# EAGLE design KimCard-v2 (EAGLE 5.11)
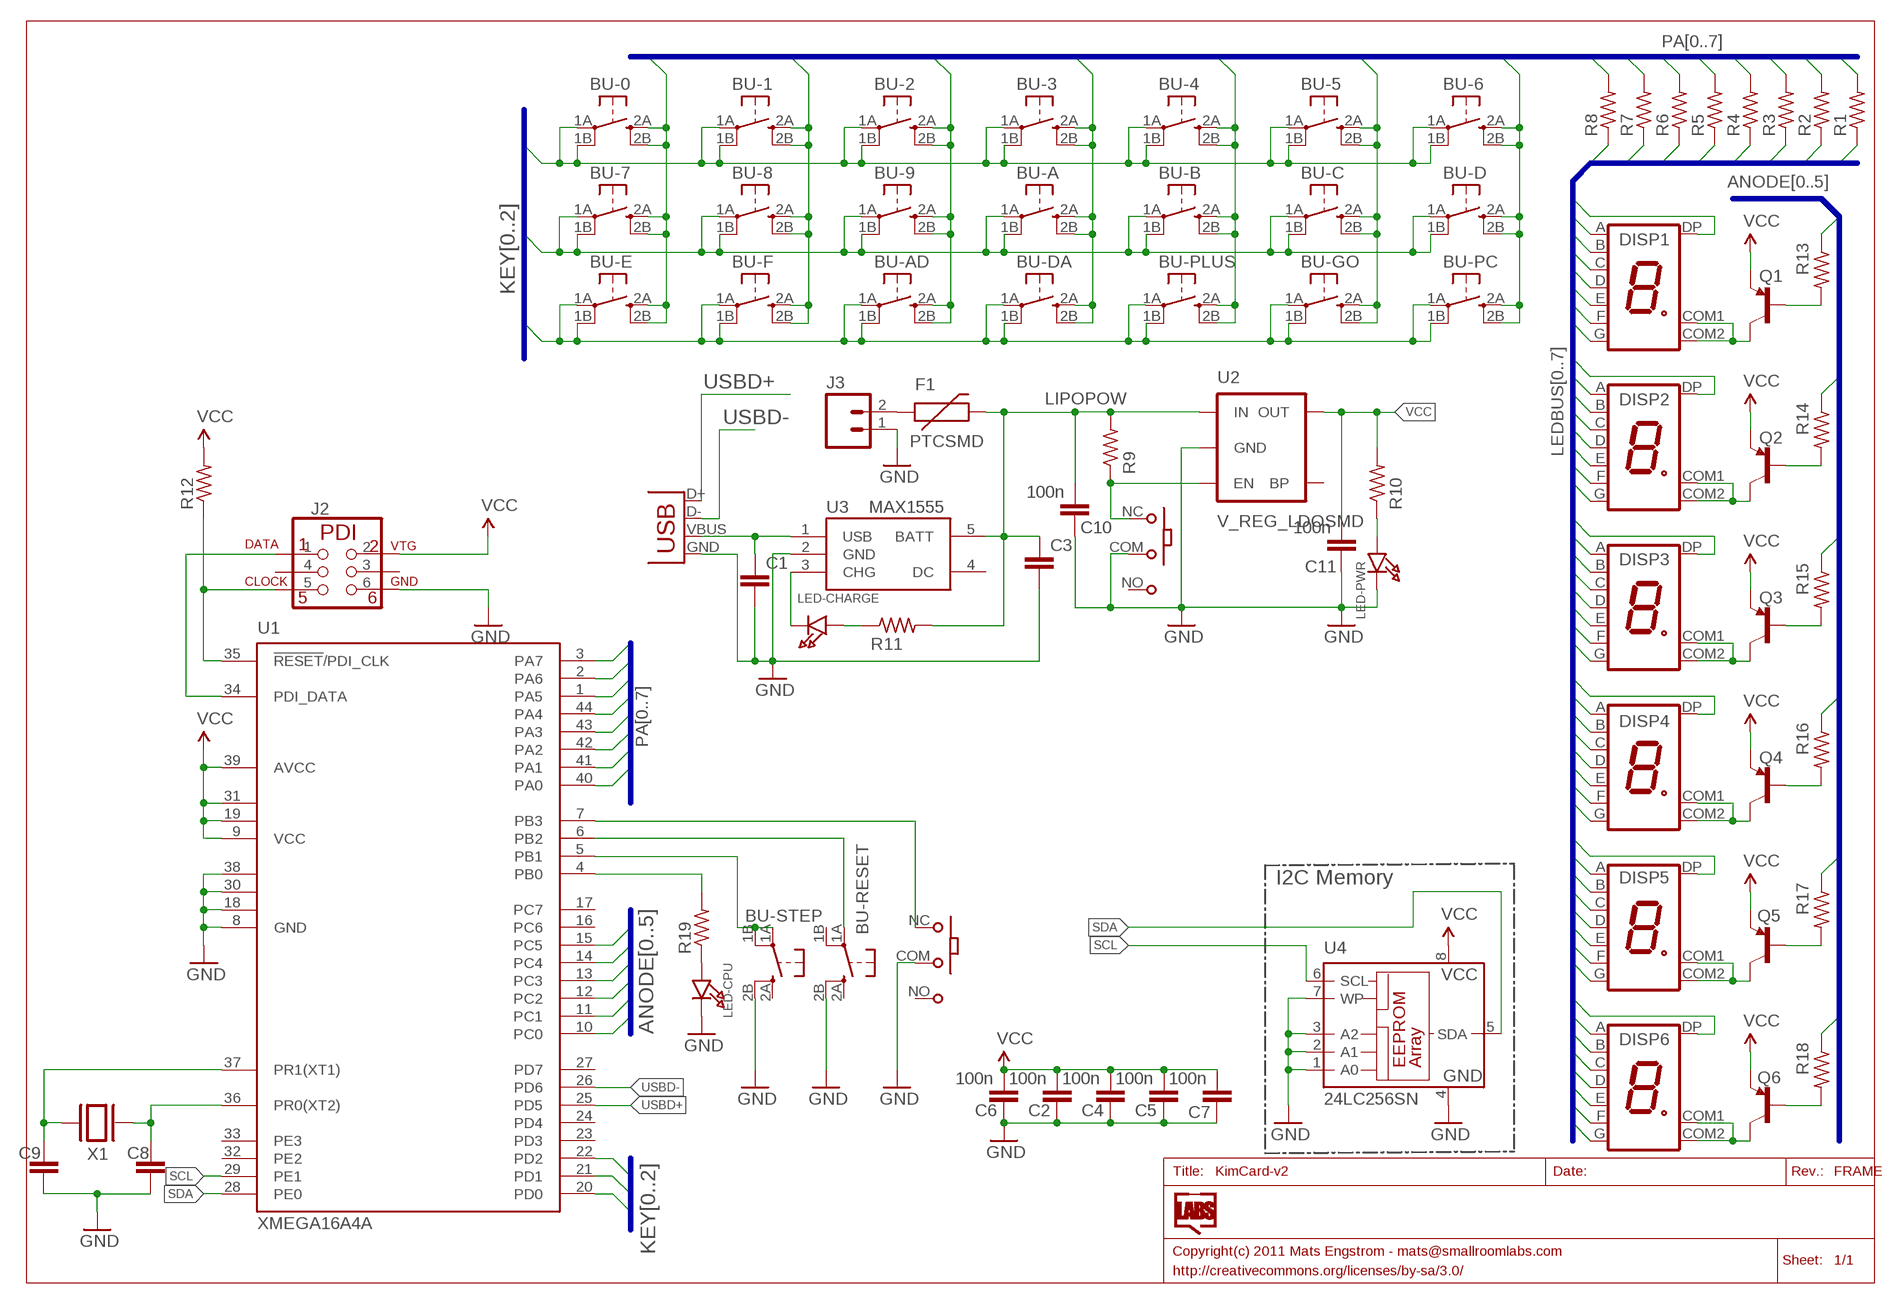
[diagram p0: schematic, sheet 1]

## Parts
BU-0  TACTILE  [EVQ-Q2]
BU-1  TACTILE  [EVQ-Q2]
BU-2  TACTILE  [EVQ-Q2]
BU-3  TACTILE  [EVQ-Q2]
BU-4  TACTILE  [EVQ-Q2]
BU-5  TACTILE  [EVQ-Q2]
BU-6  TACTILE  [EVQ-Q2]
BU-7  TACTILE  [EVQ-Q2]
BU-8  TACTILE  [EVQ-Q2]
BU-9  TACTILE  [EVQ-Q2]
BU-A  TACTILE  [EVQ-Q2]
BU-AD  TACTILE  [EVQ-Q2]
BU-B  TACTILE  [EVQ-Q2]
BU-C  TACTILE  [EVQ-Q2]
BU-D  TACTILE  [EVQ-Q2]
BU-DA  TACTILE  [EVQ-Q2]
BU-E  TACTILE  [EVQ-Q2]
BU-F  TACTILE  [EVQ-Q2]
BU-GO  TACTILE  [EVQ-Q2]
BU-PC  TACTILE  [EVQ-Q2]
BU-PLUS  TACTILE  [EVQ-Q2]
BU-RESET  TACTILE  [EVQ-Q2]
BU-STEP  TACTILE  [EVQ-Q2]
C1  CAP0805  [0805]
C2  100n  CAP0805  [0805]
C3  CAP0805  [0805]
C4  100n  CAP0805  [0805]
C5  100n  CAP0805  [0805]
C6  100n  CAP0805  [0805]
C7  100n  CAP0805  [0805]
C8  CAP0805  [0805]
C9  CAP0805  [0805]
C10  100n  CAP0805  [0805]
C11  100n  CAP0805  [0805]
DISP1  7SEG  [TDS11]
DISP2  7SEG  [TDS11]
DISP3  7SEG  [TDS11]
DISP4  7SEG  [TDS11]
DISP5  7SEG  [TDS11]
DISP6  7SEG  [TDS11]
F1  PTCSMD  [PTC-1206]
J1  USB-MICROB  [USB-MICROB]
J2  PDI-EXTRA  [ISP-TOUCH-PDI-SOLDER]
J3  LIPO-BAT  M02-JST-2MM-SMT  [JST-2-SMD]
LED-CHARGE  LEDSMD0805  [CHIPLED_0805]
LED-CPU  LEDSMD0805  [CHIPLED_0805]
LED-PWR  LEDSMD0805  [CHIPLED_0805]
Q1  TRANSISTOR_PNPSMD  [SOT23-3]
Q2  TRANSISTOR_PNPSMD  [SOT23-3]
Q3  TRANSISTOR_PNPSMD  [SOT23-3]
Q4  TRANSISTOR_PNPSMD  [SOT23-3]
Q5  TRANSISTOR_PNPSMD  [SOT23-3]
Q6  TRANSISTOR_PNPSMD  [SOT23-3]
R1  RES0805A  [R0805A]
R2  RES0805A  [R0805A]
R3  RES0805A  [R0805A]
R4  RES0805A  [R0805A]
R5  RES0805A  [R0805A]
R6  RES0805A  [R0805A]
R7  RES0805A  [R0805A]
R8  RES0805A  [R0805A]
R9  RES0805A  [R0805A]
R10  RES0805A  [R0805A]
R11  RES0805A  [R0805A]
R12  RES0805A  [R0805A]
R13  RES0805A  [R0805A]
R14  RES0805A  [R0805A]
R15  RES0805A  [R0805A]
R16  RES0805A  [R0805A]
R17  RES0805A  [R0805A]
R18  RES0805A  [R0805A]
R19  RES0805A  [R0805A]
U1  XMEGA16A4A  [TQFP44]
U2  V_REG_LDOSMD  [SOT23-5]
U3  MAX1555  [SOT23-5]
U4  24LC256SN  [SO-08]
U$1  SLIDESWITCHPCM12SMTR  [PCM12SMTR]
U$2  SLIDESWITCHPCM12SMTR  [PCM12SMTR]
X1  XTAL12SMX-B  [12SMX-B]

## Nets
CHRG-A: LED-CHARGE.C U3.3(CHG)
CHRG-B: LED-CHARGE.A R11.1
CPU: R19.2 U1.4(PB0)
GND [pwr2]: BU-RESET.2B BU-STEP.2B C1.2 C2.1 C3.2 C4.1 C5.1 C6.1 C7.1 C8.1 C9.1 C10.1 C11.1 J1.GND J2.6(GND) J3.1 LED-CPU.C LED-PWR.C U1.8(GND) U1.18(GND1) U1.30(GND2) U1.38(GND3) U2.2(GND) U3.2(GND) U4.1(A0) U4.2(A1) U4.3(A2) U4.4(GND) U4.7(WP) U$1.COM U$2.COM
KEYROW0: BU-0.1A BU-0.1B BU-1.1A BU-1.1B BU-2.1A BU-2.1B BU-3.1A BU-3.1B BU-4.1A BU-4.1B BU-5.1A BU-5.1B BU-6.1A BU-6.1B U1.20(PD0)
KEYROW1: BU-7.1A BU-7.1B BU-8.1A BU-8.1B BU-9.1A BU-9.1B BU-A.1A BU-A.1B BU-B.1A BU-B.1B BU-C.1A BU-C.1B BU-D.1A BU-D.1B U1.21(PD1)
KEYROW2: BU-AD.1A BU-AD.1B BU-DA.1A BU-DA.1B BU-E.1A BU-E.1B BU-F.1A BU-F.1B BU-GO.1A BU-GO.1B BU-PC.1A BU-PC.1B BU-PLUS.1A BU-PLUS.1B U1.22(PD2)
LEDBUS0: DISP1.A DISP2.A DISP3.A DISP4.A DISP5.A DISP6.A R1.1
LEDBUS1: DISP1.B DISP2.B DISP3.B DISP4.B DISP5.B DISP6.B R2.1
LEDBUS2: DISP1.C DISP2.C DISP3.C DISP4.C DISP5.C DISP6.C R3.1
LEDBUS3: DISP1.D DISP2.D DISP3.D DISP4.D DISP5.D DISP6.D R4.1
LEDBUS4: DISP1.E DISP2.E DISP3.E DISP4.E DISP5.E DISP6.E R5.1
LEDBUS5: DISP1.F DISP2.F DISP3.F DISP4.F DISP5.F DISP6.F R6.1
LEDBUS6: DISP1.G DISP2.G DISP3.G DISP4.G DISP5.G DISP6.G R7.1
LEDBUS7: DISP1.DP DISP2.DP DISP3.DP DISP4.DP DISP5.DP DISP6.DP R8.1
LEDCA0: R13.1 U1.10(PC0)
LEDCA1: R14.1 U1.11(PC1)
LEDCA2: R15.1 U1.12(PC2)
LEDCA3: R16.1 U1.13(PC3)
LEDCA4: R17.1 U1.14(PC4)
LEDCA5: R18.1 U1.15(PC5)
LIPO+ [pwr1]: F1.1 J3.2
LIPOPOW [pwr2]: C3.1 C10.2 F1.2 R9.2 R11.2 U2.1(IN) U3.5(BATT)
N$1: C8.2 U1.36(PR0(XT2)) X1.XTAL1
N$5: LED-PWR.A R10.1
N$7: LED-CPU.A R19.1
PA0: BU-0.2A BU-0.2B BU-7.2A BU-7.2B BU-E.2A BU-E.2B R1.2 U1.40(PA0)
PA1: BU-1.2A BU-1.2B BU-8.2A BU-8.2B BU-F.2A BU-F.2B R2.2 U1.41(PA1)
PA2: BU-2.2A BU-2.2B BU-9.2A BU-9.2B BU-AD.2A BU-AD.2B R3.2 U1.42(PA2)
PA3: BU-3.2A BU-3.2B BU-A.2A BU-A.2B BU-DA.2A BU-DA.2B R4.2 U1.43(PA3)
PA4: BU-4.2A BU-4.2B BU-B.2A BU-B.2B BU-PLUS.2A BU-PLUS.2B R5.2 U1.44(PA4)
PA5: BU-5.2A BU-5.2B BU-C.2A BU-C.2B BU-GO.2A BU-GO.2B R6.2 U1.1(PA5)
PA6: BU-6.2A BU-6.2B BU-D.2A BU-D.2B BU-PC.2A BU-PC.2B R7.2 U1.2(PA6)
PA7: R8.2 U1.3(PA7)
PDI_CLOCK: J2.5(CLOCK) R12.1 U1.35(!RESET!/PDI_CLK)
PDI_DATA: J2.1(DATA) U1.34(PDI_DATA)
POWER-ENABLE: R9.1 U2.3(EN) U$1.NC
Q1B: Q1.1(B) R13.2
Q1C: DISP1.COM1(CA) DISP1.COM2(CA) Q1.3(C)
Q2B: Q2.1(B) R14.2
Q2C: DISP2.COM1(CA) DISP2.COM2(CA) Q2.3(C)
Q3B: Q3.1(B) R15.2
Q3C: DISP3.COM1(CA) DISP3.COM2(CA) Q3.3(C)
Q4B: Q4.1(B) R16.2
Q4C: DISP4.COM1(CA) DISP4.COM2(CA) Q4.3(C)
Q5B: Q5.1(B) R17.2
Q5C: DISP5.COM1(CA) DISP5.COM2(CA) Q5.3(C)
Q6B: Q6.1(B) R18.2
Q6C: DISP6.COM1(CA) DISP6.COM2(CA) Q6.3(C)
RSET: BU-RESET.1A U1.6(PB2)
SCL: U1.29(PE1) U4.6(SCL)
SDA: U1.28(PE0) U4.5(SDA)
SST: U1.7(PB3) U$2.NC
STEP: BU-STEP.1A BU-STEP.1B U1.5(PB1)
USBD+: J1.D+ U1.25(PD5)
USBD-: J1.D- U1.26(PD6)
USBPOW [pwr1]: C1.1 J1.VBUS U3.1(USB)
VCC [pwr1]: C2.2 C4.2 C5.2 C6.2 C7.2 C11.2 J2.2(VTG) Q1.2(E) Q2.2(E) Q3.2(E) Q4.2(E) Q5.2(E) Q6.2(E) R10.2 R12.2 U1.9(VCC) U1.19(VCC1) U1.31(VCC2) U1.39(AVCC) U2.5(OUT) U4.8(VCC)
XTAL1: C9.2 U1.37(PR1(XT1)) X1.XTAL2
Unconnected: BU-RESET.1B BU-RESET.2A BU-STEP.2A J2.3(N/C2) J2.4(N/C1) U1.16(PC6) U1.17(PC7) U1.23(PD3) U1.24(PD4) U1.27(PD7) U1.32(PE2) U1.33(PE3) U2.4(BP) U3.4(DC) U$1.NO U$2.NO

## Buses
LEDBUS[0..7]
PA[0..7]
ANODE[0..5]
KEY[0..2]

## Notes on the sheet
- I2C Memory

## Library data of the parts
BU-0 BU-1-BU-9 BU-A BU-AD BU-B BU-C BU-D BU-DA BU-E BU-F BU-GO BU-PC BU-PLUS BU-RESET BU-STEP = SmallRoomLabs:TACTILE
C1-C11 = SparkFun:CAP: Capacitor Standard 0603 ceramic capacitor, and 0.1" leaded capacitor.
DISP1-DISP6 = Nerdlabs:7SEG
F1 = SparkFun:PTC: Resettable Fuse PTC Resettable Fuse. Spark Fun Electronics SKU : COM-08357
J1 = SparkFun:USB: USB Connectors USB-B-PTH is fully proven SKU : PRT-00139 USB-miniB is fully proven SKU : PRT-00587 USB-A-PCB is untested. USB-A-H is throughly reviewed, but untested. Spark Fun Electronics SKU : PRT-00437 USB-B-SMT is throughly reviewed, but untested. Needs silkscreen touching up. USB-A-S has not been used/tested USB-MB-H has not been used/tested
J2 = SmallRoomLabs:PDI
J3 = SparkFun:M02: Header 2 Standard 2-pin 0.1" header. Use with straight break away headers (SKU : PRT-00116), right angle break away headers (PRT-00553), swiss pins (PRT-00743), machine pins (PRT-00117), and female headers (PRT-00115). Molex polarized connector foot print use with SKU : PRT-08233 with associated crimp pins and housings.
LED-CHARGE LED-CPU LED-PWR = SmallRoomLabs:LED
Q1-Q6 = SparkFun:TRANSISTOR_PNP
R1-R19 = SmallRoomLabs:RES
U1 = atmel:XMEGA16A4: MICROCONTROLLER Features High-performance, Low-power 8/16-bit AVR XMEGA Microcontroller Non-Volatile Program and Data Memories - 16 KB - 128 KB of In-System Self-Programmable Flash - 4 KB - 8 KB Boot Code Section with Independent Lock Bits - 1 KB - 2 KB EEPROM - 2 KB - 8 KB Internal SRAM Peripheral Features - Four-channel DMA Controller with support for external requests - Eight-channel Event System - Five 16-bit Timer/Counters Three Timer/Counters with 4 Output Compare or Input Capture channels Two Timer/Counters with 2 Output Compare or Input Capture channels High-Resolution Extensions on all Timer/Counters Advanced Waveform Extension on one Timer/Counter - Five USARTs IrDA Extension on one USART - Two Two-Wire Interfaces with dual address match (I2C and SMBus compatible) - Two SPIs (Serial Peripheral Interfaces) peripherals - AES and DES Crypto Engine - 16-bit Real Time Counter with Separate Oscillator - One Twelve-channel, 12-bit, 2 Msps Analog to Digital Converter - One Two-channel, 12-bit, 1 Msps Digital to Analog Converter - Two Analog Comparators with Window compare function - External Interrupts on all General Purpose I/O pins - Programmable Watchdog Timer with Separate On-chip Ultra Low Power Oscillator Special Microcontroller Features - Power-on Reset and Programmable Brown-out Detection - Internal and External Clock Options with PLL - Programmable Multi-level Interrupt Controller - Sleep Modes: Idle, Power-down, Standby, Power-save, Extended Standby - Advanced Programming, Test and Debugging Interfaces PDI (Program and Debug Interface) for programming, test and debugging I/O and Packages - 34 Programmable I/O Lines - 44 - lead TQFP - 44 - pad VQFN/QFN - 49 - ball VFBGA Operating Voltage - 1.6 - 3.6V Speed performance - 0 - 12 MHz @ 1.6 - 3.6V - 0 - 32 MHz @ 2.7 - 3.6V Drawn by Dipl.-Ing. (FH) Robert Siegler Created: 27.05.09; OC_FARNELL: unknown; OC_NEWARK: unknown
U2 = SparkFun:V_REG_LDO: Voltage Regulator LDO Standard 150mA LDO voltage regulator in SOT-23 layout. Micrel part MIC5205. BP (by-pass) pin is used to lower output noise with 470pF cap.
U3 = SparkFun:MAX1555: MAX1555 Lithium Charger IC SOT-23 Lithium Polymer charging IC. Schematic element and footprint proven. Spark Fun Electronics SKU : COM-00674
U4 = microchip:24*: Serial EEPROM I2C; MF: MICROCHIP; MPN: 24LC256-I/SN; OC_FARNELL: 9757996; OC_NEWARK: 27C9144
U$1 U$2 = Nerdlabs:SLIDESWITCH
X1 = SmallRoomLabs:XTAL

## Net classes
0 default: width 0.203 mm, drill 0.305 mm, clearance 0.203 mm
1 pwr1: width 0.203 mm, drill 0.305 mm, clearance 0.203 mm
2 gnd1: width 0.203 mm, drill 0.305 mm, clearance 0.203 mm
3 pwr2: width 0.203 mm, drill 0.305 mm, clearance 0.203 mm

## Board
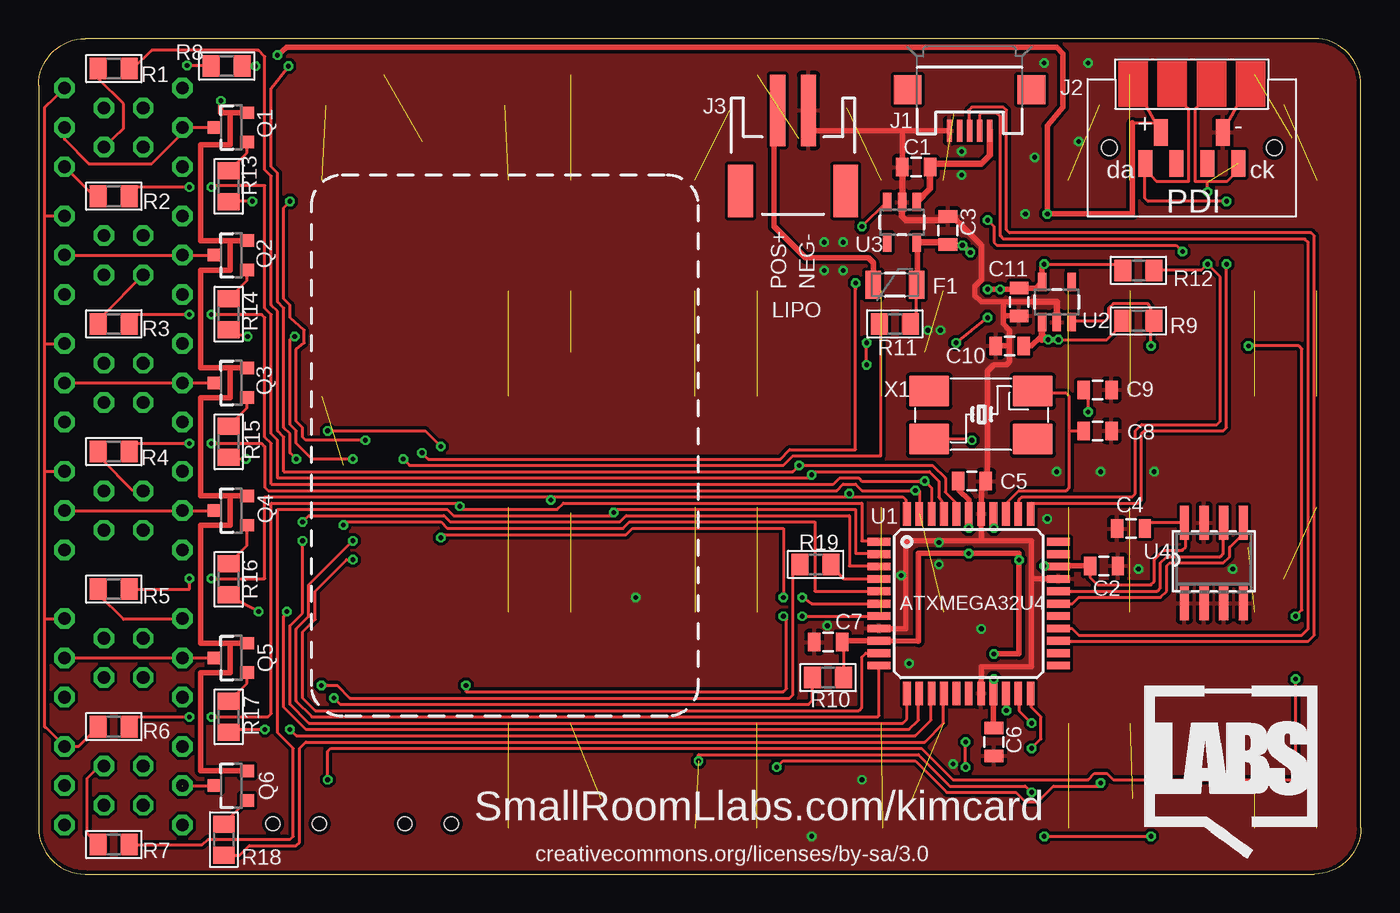
[diagram p1: board, top side]
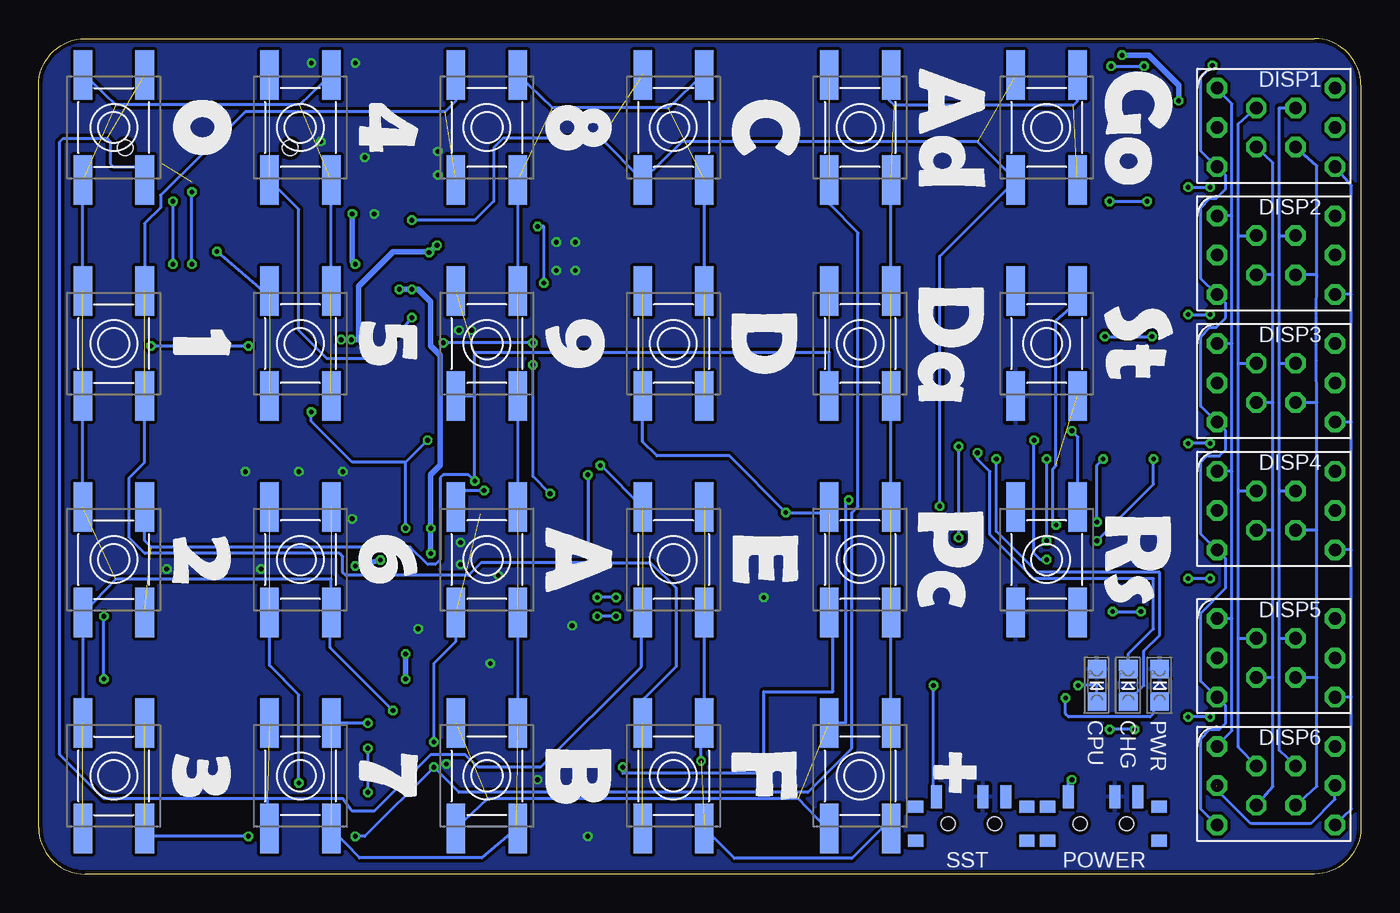
[diagram p2: board, bottom side, seen from below]

Size 85.5 x 54 mm. Coordinates in mm from the lower left corner, seen from the top.
Outline: 85.5,3 arc-90 82.5,0 3,0 arc-90 0,3 0,51 arc-90 3,54 82.5,54 arc-90 85.5,51 85.5,3
Copper layers (1*16): Top 0.035mm / dielectric 1.5mm / Bottom 0.035mm
Design rules "Fusion_eagle_rule_v1.1": minimum track width 6mil, minimum drill 12mil, track to track 6mil, track to pad 6mil, pad to pad 6mil, via to via 6mil, smd to smd 0mil, copper to edge 10mil, drill to drill 10mil, minimum pad ring 10mil, minimum via ring 6mil, stop-mask expansion 2mil, vias tented up to drill 100mil, thermal gap 10mil

### Footprints (pad centres in the part's own frame; a part is rotated, then mirrored left to right if it is on the bottom)
EVQ-Q2 = smd 3.2 x 1.2: 1A -3.4,2; 1B 3.4,2; 2A -3.4,-2; 2B 3.4,-2
0805 = smd 0.8 x 1.2: 1 -0.9,0; 2 0.9,0
TDS11 = drill 0.813 octagon: A 1.27,1.27; B 2.54,3.81; C 1.27,-1.27; COM1 0,-3.81; COM2 0,3.81; D -1.27,-1.27; DP 2.54,-3.81; E -2.54,-3.81; F -2.54,3.81; G -1.27,1.27
PTC-1206 = smd 1 x 1.8: 1 -1.4,0; 2 1.4,0
USB-MICROB = smd 0.35 x 1.4: D+ 0,2.65; D- -0.65,2.65; GND 1.3,2.65; ID 0.65,2.65; VBUS -1.3,2.65 | smd 1.8 x 1.9: MT1 -4,0; MT2 4,0
ISP-TOUCH-PDI-SOLDER = smd 0.9 x 1.7: 1 -3,-1; 2 -2,1; 3 -1,-1; 4 1,-1; 5 3,-1; 6 2,1 | hole 1: -5.334,0; 5.334,0
JST-2-SMD = smd 1 x 4.6: 1 -1,-3.7; 2 1,-3.7 | smd 1.6 x 3.4: NC1 -3.4,1.5; NC2 3.4,1.5
CHIPLED_0805 = smd 1.2 x 1.2: A 0,-1.05; C 0,1.05
SOT23-3 = smd 0.8 x 0.9: 1 -0.95,-1; 2 0.95,-1; 3 0,1.1
R0805A = smd 1.1 x 1.4: 1 -1,0; 2 1,0
TQFP44 = smd 1.5 x 0.5: 1 -5.8,4; 2 -5.8,3.2; 3 -5.8,2.4; 4 -5.8,1.6; 5 -5.8,0.8; 6 -5.8,0; 7 -5.8,-0.8; 8 -5.8,-1.6; 9 -5.8,-2.4; 10 -5.8,-3.2; 11 -5.8,-4; 23 5.8,-4; 24 5.8,-3.2; 25 5.8,-2.4; 26 5.8,-1.6; 27 5.8,-0.8; 28 5.8,0; 29 5.8,0.8; 30 5.8,1.6; 31 5.8,2.4; 32 5.8,3.2; 33 5.8,4 | smd 0.5 x 1.5: 12 -4,-5.8; 13 -3.2,-5.8; 14 -2.4,-5.8; 15 -1.6,-5.8; 16 -0.8,-5.8; 17 0,-5.8; 18 0.8,-5.8; 19 1.6,-5.8; 20 2.4,-5.8; 21 3.2,-5.8; 22 4,-5.8; 34 4,5.8; 35 3.2,5.8; 36 2.4,5.8; 37 1.6,5.8; 38 0.8,5.8; 39 0,5.8; 40 -0.8,5.8; 41 -1.6,5.8; 42 -2.4,5.8; 43 -3.2,5.8; 44 -4,5.8
SOT23-5 = smd 0.55 x 1.2: 1 -0.95,-1.3; 2 0,-1.3; 3 0.95,-1.3; 4 0.95,1.3; 5 -0.95,1.3
SO-08 = smd 0.6 x 2.2: 1 -1.905,-2.6; 2 -0.635,-2.6; 3 0.635,-2.6; 4 1.905,-2.6; 5 1.905,2.6; 6 0.635,2.6; 7 -0.635,2.6; 8 -1.905,2.6
PCM12SMTR = smd 0.7 x 1.5: COM 0.75,1.75; NC -2.25,1.75; NO 2.25,1.75 | smd 1 x 0.8: P$1 -3.6,-1.1; P$2 -3.6,1.1; P$3 3.6,1.1; P$4 3.6,-1.1 | hole 0.9: -1.5,0; 1.5,0
12SMX-B = smd 2.6 x 2: NU1 -3.3,1.6; NU2 3.4,-1.5; XTAL1 -3.3,-1.5; XTAL2 3.4,1.6

### Placement (x,y rotation side)
BU-0  80.64,48.26 90 bottom
BU-1  80.64,34.29 90 bottom
BU-2  80.64,20.32 90 bottom
BU-3  80.64,6.35 90 bottom
BU-4  68.58,48.26 270 bottom
BU-5  68.58,34.29 270 bottom
BU-6  68.58,20.32 270 bottom
BU-7  68.58,6.35 270 bottom
BU-8  56.51,48.26 270 bottom
BU-9  56.51,34.29 270 bottom
BU-A  56.51,20.32 270 bottom
BU-AD  32.38,34.29 270 bottom
BU-B  56.51,6.35 270 bottom
BU-C  44.45,48.26 270 bottom
BU-D  44.45,34.29 270 bottom
BU-DA  32.38,48.26 270 bottom
BU-E  44.45,20.32 270 bottom
BU-F  44.45,6.35 270 bottom
BU-GO  20.32,48.26 270 bottom
BU-PC  32.38,20.32 270 bottom
BU-PLUS  32.38,6.35 270 bottom
BU-RESET  20.32,20.32 270 bottom
BU-STEP  20.32,34.29 270 bottom
C1  56.74,45.69 180 top
C2  68.88,19.91 180 top
C3  58.8,41.61 90 top
C4  70.64,22.33 0 top
C5  60.35,25.4 180 top
C6  61.77,8.53 90 top
C7  51.05,14.99 0 top
C8  68.48,28.65 180 top
C9  68.48,31.29 180 top
C10  62.79,34.14 0 top
C11  63.4,36.98 90 top
DISP1  5.49,48.26 270 bottom
DISP2  5.49,40.01 270 bottom
DISP3  5.49,31.75 270 bottom
DISP4  5.49,23.5 270 bottom
DISP5  5.49,13.97 270 bottom
DISP6  5.49,5.71 270 bottom
F1  55.37,38.1 0 top
J1  60.2,50.7 180 top
J2  74.57,46.94 0 top
J3  48.78,45.66 180 top
LED-CHARGE  15.04,12.19 0 bottom
LED-CPU  17.07,12.19 0 bottom
LED-PWR  13,12.19 0 bottom
Q1  12.47,48.26 90 top
Q2  12.47,40.01 90 top
Q3  12.47,31.75 90 top
Q4  12.47,23.5 90 top
Q5  12.47,13.97 90 top
Q6  12.47,5.71 90 top
R1  4.85,52.07 0 top
R2  4.85,43.81 0 top
R3  4.85,35.56 0 top
R4  4.85,27.3 0 top
R5  4.85,18.41 0 top
R6  4.85,9.53 0 top
R7  4.85,1.91 0 top
R8  12.16,52.23 0 top
R9  71.12,35.76 180 top
R10  51.05,12.7 0 top
R11  55.37,35.56 0 top
R12  71.12,39.01 180 top
R13  12.29,44.45 90 top
R14  12.29,36.2 90 top
R15  12.29,27.94 90 top
R16  12.29,19.05 90 top
R17  12.29,10.16 90 top
R18  11.97,2.22 90 top
R19  50.24,20.02 0 top
U1  60.15,17.48 0 top
U2  65.84,36.98 0 top
U3  55.83,42.13 180 top
U4  76,20.12 0 top
U$1  16.66,3.25 0 bottom
U$2  25.2,3.25 0 bottom
U$3  [SRL-LOGO-SILK-10MM]  71.52,1.02 0 top
X1  60.98,29.72 180 top

### Tracks (layer width: path | path; a pad name or v marks a point on that pad's centre or on a via)
CHRG-A  (via drill 0.3)
  Top 0.203: 52.83,37.8 v52.83,38.2 52.83,27.43 48.56,27.43 47.95,26.82 25.2,26.82 v24.79,27.23 | v53.24,41.86 54.81,43.43 U3.3
  Bottom 0.203: v53.24,41.86 52.83,41.86 v52.83,38.2 | LED-CHARGE.C 15.04,14.22 13.41,15.85 13.41,19.1 21.13,19.1 23.98,21.95 23.98,26.01 24.79,26.82 v24.79,27.23
CHRG-B  (via drill 0.3)
  Top 0.203: R11.1 54.46,35.56 54.46,27.03 48.77,27.03 48.16,26.42 23.98,26.42 v23.57,26.82
  Bottom 0.203: LED-CHARGE.A 15.04,11.18 14.02,12.19 14.02,14.43 13,15.44 13,19.51 20.93,19.51 23.57,22.15 v23.57,26.82
CPU
  Top 0.203: U1.4 52.05,19.07 R19.2
GND  (via drill 0.3)
  Top 0.356: 54.37,15.85 56.08,15.85 56.08,21.54 60.96,21.54 | 60.96,21.54 U1.38 60.96,24.79 61.36,25.2 61.36,32.51 61.77,32.92 62.58,32.92 62.79,33.12 62.79,34.14 | 60.96,21.54 64.21,21.54 64.21,19.1 | 64.21,19.1 U1.30 | U1.18 60.96,13.41 64.21,13.41 64.21,19.1 | J3.1 49.78,48.05 55.84,48.05 | C1.2 55.84,48.05 | 55.84,48.05 J1.GND | C3.2 58.8,42.27 59.33,42.27 60.96,40.64 60.96,38.41 60.55,38 60.55,37.39 60.96,36.98 62.38,36.98 | 62.79,34.14 62.79,35.15 62.38,35.56 62.38,35.97 | 62.38,36.98 64.3,36.98 | 62.38,35.97 62.38,36.98 | C11.1 62.5,36.08 62.38,35.97 | 62.79,34.14 C10.1
  Top 0.406: U2.2 65.84,36.98 64.3,36.98 | C1.2 55.84,43.44 U3.2 55.83,42.52 56.08,42.27 58.56,42.27 C3.2 | U1.8 54.37,15.85 | U1.30 65.92,19.1 | U1.38 60.96,23.26
  other vias: 67.87,52.43 65.02,52.43 63.8,42.67 67.26,47.35 38.61,17.88 60.96,15.85 49.99,2.44 65.84,26.01 58.22,21.44 58.22,20.02 51,16.05 59.13,7.11 53.24,6.1 50.8,40.84 52.02,40.84 52.02,39.01 50.8,39.01 58.32,35.15 57.5,35.15 64.41,46.33 56.29,13.61 55.78,19.3 68.68,26.01 72.13,26.01 59.69,46.71 59.69,45.19 71.12,19.71 65.23,22.96 77.21,19.71
  pour Bottom: 57,54 82.5,54 arc-90 85.5,51 85.5,31.5 85.5,3 arc-90 82.5,0 22,0 3,0 arc-90 0,3 0,43.5 0,51 arc-90 3,54
  pour Top: 57,54 82.5,54 arc-90 85.5,51 85.5,31.5 85.5,3 arc-90 82.5,0 22,0 3,0 arc-90 0,3 0,43.5 0,51 arc-90 3,54
KEYROW0  (via drill 0.3)  (7 unrouted)
  Top 0.203: U1.20 62.55,10.57 v62.58,10.57
  Bottom 0.203: BU-3.1B BU-2.1A 82.55,16.92 80.52,19.05 66.58,19.05 BU-6.1B 66.65,16.85 66.65,14.63 v62.58,10.57 | BU-2.1B BU-1.1A | BU-1.1B BU-0.1A | BU-4.1A 68.61,49.73 80.52,49.73 82.55,51.66 BU-0.1B | BU-5.1A BU-4.1B
KEYROW1  (via drill 0.3)  (7 unrouted)
  Top 0.203: U1.21 63.4,11.62 63.4,10.57 v64.21,9.75
  Bottom 0.203: BU-7.1B 64.75,1.04 56.84,1.04 54.61,2.95 BU-B.1B | BU-B.1A BU-A.1B | BU-A.1A BU-9.1B | BU-9.1A BU-8.1B | BU-D.1A BU-C.1B | BU-8.1A 52.28,49.53 44.78,49.53 42.54,51.66 BU-C.1A | v64.21,9.75 64.13,9.75 BU-7.1A
KEYROW2  (via drill 0.3)  (7 unrouted)
  Top 0.203: v64.21,5.28 63.8,5.69 58.93,5.69 56.89,7.72 42.67,7.72 v42.67,7.32 | U1.22 64.21,11.61 64.21,10.77 64.82,10.16 64.82,8.74 v64.21,8.13
  Bottom 0.203: 30.48,51.66 BU-DA.1A 30.48,51.56 30.48,49.99 30.17,49.68 18.59,49.68 18.32,49.95 BU-GO.1A | BU-AD.1A BU-DA.1B | BU-PC.1A BU-AD.1B | BU-PLUS.1A BU-PC.1B | 42.54,2.95 BU-F.1B 40.51,1.02 32.92,1.02 30.98,2.95 BU-PLUS.1B | BU-E.1B BU-F.1A 42.67,9.75 v42.67,7.32 | v64.21,5.28 v64.21,8.13
LEDBUS0
  Top 0.203: 4.06,52.07 R1.1 3.86,51.41 5.48,49.78 5.48,48.21 DISP1.A
  Bottom 0.203: 2.84,30.48 arc2 2.84,38.61 2.84,38.73 | 2.84,12.7 2.84,22.23 | 2.84,12.7 DISP5.A | 2.84,12.7 2.84,5.66 DISP6.A | 2.84,22.23 DISP4.A | 2.84,22.23 2.84,30.48 | 2.84,30.48 DISP3.A | 2.84,38.73 DISP2.A | DISP1.A 2.84,45.77 2.84,38.73
LEDBUS1
  Top 0.203: R2.1 3.58,43.81 DISP1.B
  Bottom 0.203: DISP6.B 0.61,4.19 0.61,11.43 | 0.61,11.43 0.61,20.95 | 0.61,11.43 DISP5.B | 0.61,20.95 DISP4.B | 0.61,29.21 DISP3.B | 0.61,20.95 0.61,29.21 | 0.61,37.47 DISP2.B | 0.61,29.21 0.61,37.47 | DISP1.B 0.61,44.5 0.61,37.47
LEDBUS2
  Top 0.203: R3.1 4.06,35.56 4.06,36.04 DISP2.C
  Bottom 0.203: 5.69,30.48 DISP3.C | 5.69,12.7 5.69,22.23 | 5.69,12.7 DISP5.C | 5.69,22.23 DISP4.C | 5.69,22.23 5.69,30.48 | DISP1.C 5.69,45.97 5.69,38.73 | 5.69,30.48 5.69,38.73 | DISP6.C 5.69,5.66 5.69,12.7 | 5.69,38.73 DISP2.C
LEDBUS3
  Top 0.203: R4.1 4.06,27.3 4.06,26.82 6.09,24.79 6.73,24.79 DISP4.D
  Bottom 0.203: 7.92,33.02 7.92,41.27 | DISP6.D 7.92,8.2 7.92,15.24 | 7.92,15.24 DISP5.D | 7.92,33.02 DISP3.D | 7.92,15.24 7.92,24.77 | 7.92,41.27 DISP2.D | 7.92,41.27 7.92,48.51 DISP1.D | 7.92,24.77 DISP4.D | 7.92,24.77 7.92,33.02
LEDBUS4
  Top 0.203: R5.1 3.91,18.41 3.91,18.03 5.48,16.46 9.25,16.46 DISP5.E
  Bottom 0.203: 8.33,26.04 8.33,34.29 | 8.33,42.55 8.33,49.78 DISP1.E | DISP6.E 8.33,9.27 8.33,16.51 | 8.33,16.51 DISP5.E | 8.33,26.04 DISP4.E | 8.33,16.51 8.33,26.04 | 8.33,34.29 DISP3.E | 8.33,42.55 DISP2.E | 8.33,34.29 8.33,42.55
LEDBUS5
  Top 0.203: 0.4,34.29 0.4,42.55 | 0.4,26.04 DISP4.F | 0.4,16.51 0.4,9.47 0.46,9.47 DISP6.F 2.58,8.26 R6.1 | 0.4,34.29 DISP3.F | 0.4,26.04 0.4,34.29 | 0.4,42.55 DISP2.F | 0.4,42.55 0.4,49.58 DISP1.F | 0.4,16.51 DISP5.F | 0.4,16.51 0.4,26.04
LEDBUS6
  Top 0.203: DISP6.G 3.94,6.99 3.15,6.2 3.15,2.61 R7.1
  Bottom 0.203: 5.28,24.79 DISP4.G | 5.28,41.27 5.28,49.53 DISP1.G | 5.28,15.24 5.28,24.79 | DISP6.G 5.28,8 5.28,15.24 | 5.28,15.24 DISP5.G | 5.28,33.02 DISP3.G | 5.28,24.79 5.28,33.02 | 5.28,41.27 DISP2.G | 5.28,33.02 5.28,41.27
LEDBUS7  (via drill 0.3)
  Top 0.203: v9.6,52.27 11.16,52.27 R8.1
  Bottom 0.203: DISP6.DP 10.36,4.19 10.36,8.74 9.75,9.35 9.14,9.35 8.74,9.75 8.74,10.87 DISP5.DP 10.36,12.45 10.36,16.87 8.74,18.49 8.74,20.39 DISP4.DP 10.36,21.97 10.36,26.62 9.96,27.03 9.14,27.03 8.74,27.43 8.74,28.65 DISP3.DP 10.36,30.23 10.36,34.75 9.75,35.36 9.35,35.36 8.74,35.97 8.74,36.9 DISP2.DP 10.36,38.48 10.36,43.08 9.75,43.69 9.35,43.69 8.74,44.3 8.74,45.16 DISP1.DP 10.36,46.74 10.36,51.51 v9.6,52.27
LEDCA0  (via drill 0.3)
  Top 0.203: 12.29,43.48 R13.1 12.32,43.48 v13.82,43.48 | 54.35,14.22 U1.10 53.49,14.28 53.24,14.02 53.24,10.77 53.03,10.57 17.88,10.57 17.07,11.38 17.07,15.65 17.88,16.46 17.88,18.29 19.91,20.32 v20.32,20.32 | v16.25,43.48 15.85,43.08 15.85,37.19 16.25,36.78 16.25,35.97 17.17,35.15 17.17,34.34 16.66,33.93 16.66,29.26 17.07,28.85 17.07,28.25 17.27,28.04 v21.13,28.04
  Bottom 0.203: v20.32,20.32 20.72,20.32 21.13,20.73 v21.13,28.04 | v16.25,43.48 v13.82,43.48
LEDCA1  (via drill 0.3)
  Top 0.203: R14.1 12.29,35.36 | R14.1 12.45,35.36 | v20.32,21.54 17.47,18.69 17.47,16.66 16.66,15.85 16.66,11.18 17.68,10.16 54.25,10.16 54.35,10.25 U1.11 | v20.32,26.82 17.68,26.82 16.66,27.84 16.66,28.65 16.25,29.06 16.25,34.54 v16.56,34.75 | v13.51,34.75 12.53,34.95 R14.1
  Bottom 0.203: v20.32,21.54 v20.32,26.82 | v16.56,34.75 v13.51,34.75
LEDCA2  (via drill 0.3)
  Top 0.203: 56.15,11.79 U1.12 56.15,10.02 55.88,9.75 17.47,9.75 16.25,10.97 16.25,16.05 17.07,16.87 v17.07,21.54 | v13.41,26.82 12.4,26.82 R15.1
  Bottom 0.203: v17.07,21.54 13.41,25.2 v13.41,26.82
LEDCA3  (via drill 0.3)
  Top 0.203: 12.29,18.29 R16.1 12.46,17.88 v14.22,16.97 | v16.05,16.97 15.85,16.66 15.85,10.77 17.27,9.35 56.28,9.35 56.89,9.96 56.89,11.62 U1.13
  Bottom 0.203: v16.05,16.97 v14.22,16.97
LEDCA4  (via drill 0.3)
  Top 0.203: v14.63,9.35 12.29,9.35 R17.1 | v16.25,9.35 16.66,8.94 56.69,8.94 57.71,9.96 57.71,11.64 U1.14
  Bottom 0.203: v14.63,9.35 v16.25,9.35
LEDCA5
  Top 0.203: U1.15 58.52,11.65 58.52,9.75 57.3,8.53 17.27,8.53 16.86,8.13 16.86,2.03 16.66,1.83 13.61,1.83 13,1.22 R18.1
LIPO+
  Top 0.356: F1.1 53.97,39.5 53.64,39.83 49.58,39.83 47.55,41.86 47.55,49.12 J3.2
LIPOPOW  (via drill 0.3)
  Top 0.203: F1.2 56.77,35.96 R11.2 | R9.2 70.12,35.58 69.09,34.54 v65.94,34.54
  Top 0.356: 56.82,40.79 56.82,38.15 F1.2 | C3.1 58.86,40.64 v59.74,40.64 v60.25,40.18 | v65.28,34.54 64.89,34.54 | v65.28,34.54 v65.94,34.54 | C10.2 64.21,34.14 64.82,34.75 65.07,34.75 v65.28,34.54
  Top 0.406: 64.89,34.54 U2.1 | C3.1 58.67,40.83 U3.5 56.82,40.79
  Bottom 0.356: v65.94,34.54 v65.28,34.54 64.82,34.54 64.82,38 62.58,40.23 60.3,40.23 v60.25,40.18 v59.74,40.64
N$1
  Top 0.203: U1.36 62.55,23.94 63.4,24.79 66.44,24.79 66.65,24.99 66.65,28.65 | 66.65,28.65 66.65,30.89 66.44,31.09 64.41,31.09 X1.XTAL1 | 66.65,28.65 C8.2
N$5  (via drill 0.3)
  Top 0.203: v19.1,11.38 19.51,10.97 49.78,10.97 50.05,11.24 R10.1
  Bottom 0.203: LED-PWR.A 13.41,10.74 13.41,10.36 13.61,10.16 18.9,10.16 19.1,10.36 v19.1,11.38
N$7  (via drill 0.3)
  Top 0.203: v18.29,12.19 19.3,12.19 20.12,11.38 48.56,11.38 48.77,11.58 48.77,19.54 R19.1
  Bottom 0.203: v18.29,12.19 17.07,12.19 LED-CPU.A
PA0  (via drill 0.3)  (3 unrouted)
  Top 0.203: R1.2 6.09,52.07 7.31,53.24 14.22,53.24 14.63,52.83 14.63,45.52 15.04,45.11 15.04,36.78 15.44,36.37 15.44,28.65 15.85,28.25 15.85,26.01 48.77,26.01 v49.17,26.42 57.81,26.42 58.62,25.6 58.62,24.69 59.35,23.96 U1.40
  Bottom 0.203: 70.71,4.88 65.84,4.88 65.23,4.06 63.8,4.06 60.15,7.72 57.91,7.72 57.1,6.91 53.03,6.91 46.53,13.41 46.53,16.84 BU-E.2B | BU-7.2B 70.71,3.08 70.71,4.88 | 70.71,4.88 81.28,4.88 84.12,7.72 84.12,47.35 83.92,47.55 81.08,47.55 80.87,47.35 80.87,45.92 80.67,45.72 78.64,45.72 BU-0.2A | v49.17,26.42 49.14,26.42 BU-E.2A
PA1  (via drill 0.3)  (3 unrouted)
  Top 0.203: R2.2 5.85,44.4 v9.75,44.4 | v11.17,44.4 11.17,44.5 14.63,44.5 14.63,36.58 15.04,36.17 15.04,28.45 15.44,28.04 15.44,25.6 49.78,25.6 v49.99,25.81 49.99,26.01 57.61,26.01 58.22,25.4 58.22,24.38 58.55,23.95 U1.41 58.52,23.3
  Bottom 0.203: v11.17,44.4 v9.75,44.4 | BU-F.2A 46.33,9.87 46.33,11.38 44.3,13.41 44.3,18.49 45.92,20.12 49.99,20.12 | v49.99,25.81 49.99,20.12 | BU-1.2A 78.64,26.61 79.65,25.6 79.65,21.74 78.64,20.73 66.04,20.73 65.84,20.52 65.84,19.51 65.63,19.3 57.71,19.3 56.89,20.12 49.99,20.12 | BU-1.2B 78.64,42.06 77.62,43.08 77.62,43.89 72.13,49.28 59.23,49.28 58.52,49.99 BU-8.2A
PA2  (via drill 0.3)  (3 unrouted)
  Top 0.203: R3.2 5.85,36.17 v9.75,36.17 | v11.17,36.17 14.43,36.17 14.63,35.97 14.63,28.25 15.04,27.84 15.04,25.2 51.41,25.2 51.81,25.6 53.03,25.6 53.24,25.4 v57.3,25.4 57.75,24.95 U1.42
  Bottom 0.203: v11.17,36.17 v9.75,36.17 | 57.3,30.89 BU-9.2B | BU-AD.2B 34.38,33.73 57.3,33.73 57.3,30.89 | 57.3,30.89 v57.3,25.4 57.71,25.81 59.33,25.81 59.54,25.6 59.54,20.32 59.84,20.02 60.35,20.02 61.47,21.13 78.23,21.13 78.64,21.54 BU-2.2B
PA3  (via drill 0.3)  (3 unrouted)
  Top 0.203: R4.2 5.85,27.84 v9.75,27.84 | U1.43 56.95,24.79 v56.69,24.79 | v65.02,2.44 v71.93,2.44 | v59.94,6.91 v59.94,8.53 | v56.69,24.79 56.49,24.79 | v11.17,27.84 14.43,27.84 14.63,27.64 14.63,24.99 14.83,24.79 51.61,24.79 52.02,25.2 52.83,25.2 53.24,24.79 v56.69,24.79
  Bottom 0.203: v9.75,27.84 v11.17,27.84 | BU-3.2A 78.64,2.44 v71.93,2.44 | BU-A.2B 58.52,15.04 59.94,13.61 v59.94,8.53 | v65.02,2.44 64.41,2.44 v59.94,6.91 58.32,5.28 35.76,5.28 32.92,8.13 32.92,23.37 32.51,23.77 32.51,41.45 34.34,43.28 34.34,44.82 BU-DA.2B | v56.69,24.79 58.11,24.79 58.32,24.59 58.32,23.92 BU-A.2A
PA4  (via drill 0.3)  (3 unrouted)
  Top 0.203: R5.2 9.75,18.41 v9.75,19.1 | v11.17,19.1 14.63,19.1 14.63,24.38 33.12,24.38 | v59.33,34.34 v61.36,35.97 | v53.54,32.92 v53.54,34.34 | U1.44 56.08,23.27 56.08,24.18 55.88,24.38 52.42,24.38 | 33.12,24.38 52.42,24.38 | 52.42,24.38 v52.42,24.59 | 33.12,24.38 v33.12,24.18
  Bottom 0.203: v9.75,19.1 v11.17,19.1 | BU-PLUS.2B 34.54,2.95 36.37,4.88 56.48,4.88 BU-B.2B | v53.54,34.34 v59.33,34.34 | v33.12,24.18 33.32,24.18 33.32,9.75 BU-PLUS.2A | BU-4.2B 68.68,42.96 68.68,35.15 66.85,33.33 63.6,33.33 v61.36,35.97 | v53.54,32.92 53.54,25.7 v52.42,24.59
PA5  (via drill 0.3)  (3 unrouted)
  Top 0.203: R6.2 5.85,10.16 v9.75,10.16 | 54.35,21.54 U1.1 54.28,21.54 53.24,21.54 53.24,23.98 33.93,23.98 33.53,23.57 27.43,23.57 v27.23,23.77 27.23,23.98 15.04,23.98 15.04,10.36 14.83,10.16 v11.17,10.16 | v73.96,40.23 73.56,40.64 61.97,40.64 61.77,40.84 61.77,41.86 v61.36,42.27
  Bottom 0.203: v9.75,10.16 v11.17,10.16 | 70.71,37.8 BU-5.2A 71.01,37.69 v73.96,40.23 | v61.36,42.27 57.3,42.27 56.08,43.48 56.08,46.94 55.47,47.55 49.14,47.55 BU-C.2B 43.89,47.35 24.79,47.35 BU-GO.2B 27.23,39.95 v27.23,23.77
PA6  (via drill 0.3)  (3 unrouted)
  Top 0.203: R7.2 10.56,1.91 10.97,2.23 16.25,2.23 16.46,2.44 16.46,8.13 15.44,9.14 15.44,23.57 26.41,23.57 26.82,23.16 37.18,23.16 v37.18,23.37 37.18,23.57 52.83,23.57 52.83,20.73 54.29,20.73 U1.2 54.35,20.73 | v47.73,6.91 48.13,7.32 56.69,7.32 58.72,5.28 63.19,5.28 63.8,4.67 64.62,4.67 65.63,5.69 68.68,5.69 v68.68,5.89
  Bottom 0.203: 70.71,15.85 70.71,16.66 BU-6.2B 70.58,13.48 68.68,11.58 v68.68,5.89 | BU-PC.2B 34.14,16.92 34.14,11.79 38.61,11.79 38.61,6.5 47.73,6.5 v47.73,6.91 | BU-D.2B 46.45,27.96 45.52,27.03 40.84,27.03 v37.18,23.37 34.38,23.37 BU-PC.2A
PA7  (via drill 0.3)
  Top 0.203: 13.16,52.43 R8.2 13.16,52.02 13.21,52.17 v14.02,52.22 | 54.35,19.91 U1.3 54.31,19.91 52.42,19.91 52.42,23.16 38,23.16 37.59,22.76 26.62,22.76 26.21,23.16 17.47,23.16 v17.07,22.76 | v16.15,52.22 15.04,50.8 15.04,45.72 15.44,45.31 15.44,36.98 15.85,36.58 15.85,28.85 16.25,28.45 16.25,27.23 v16.66,26.82
  Bottom 0.203: v16.15,52.22 v14.02,52.22 | v17.07,22.76 17.07,26.42 v16.66,26.82
PDI_CLOCK  (via drill 0.3)  (1 unrouted)
  Top 0.203: 77.57,46.53 J2.5 77.62,45.89 | U1.35 63.4,23.27 63.4,24.18 63.6,24.38 70.71,24.38 70.92,24.59 70.92,28.65 71.32,29.06 76.2,29.06 76.4,29.26 76.4,38.61 v75.59,39.42 75.18,39.01 R12.1 72.52,39.42 | v75.59,44.09 75.56,44.09 75.56,44.7
  Bottom 0.203: v75.59,39.42 v75.59,44.09
PDI_DATA  (via drill 0.3)
  Top 0.203: 71.57,46.53 J2.1 71.52,45.89 71.52,43.69 71.73,43.48 v76.81,43.48 | 64.21,23.34 U1.34 64.15,23.91 64.21,23.98 71.12,23.98 71.32,24.18 71.32,28.45 71.52,28.65 76.6,28.65 76.81,28.85 v76.81,39.42
  Bottom 0.203: v76.81,39.42 v76.81,43.48
POWER-ENABLE  (via drill 0.3)
  Top 0.203: v81.28,16.66 81.68,17.07 81.68,33.93 81.48,34.14 v78.23,34.14 | v81.28,12.6 81.28,6.1 69.49,6.1 69.09,6.5 68.27,6.5 67.87,6.1 59.13,6.1 57.1,8.13 18.9,8.13 18.69,7.92 v18.69,6.1 | v71.93,34.14 71.93,35.58 R9.1 71.93,35.95 71.93,36.58 71.73,36.88 69.49,36.88 69.19,36.58 69.19,35.97 68.97,35.75 66.85,35.75 U2.3
  Bottom 0.203: U$1.NC 18.91,6.1 v18.69,6.1 | v78.23,34.14 v71.93,34.14 | v81.28,12.6 v81.28,16.66
Q1B
  Top 0.203: Q1.1 13.47,46.64 R13.2
Q1C
  Top 0.203: DISP1.COM2 1.68,47.49 3.25,45.92 7.31,45.92 9.14,47.75 9.14,48.1 DISP1.COM1 Q1.3
Q2B
  Top 0.203: Q2.1 13.47,38.38 R14.2
Q2C
  Top 0.203: Q2.3 DISP2.COM1 DISP2.COM2
Q3B
  Top 0.203: Q3.1 13.47,30.13 R15.2
Q3C
  Top 0.203: Q3.3 DISP3.COM1 DISP3.COM2
Q4B
  Top 0.203: Q4.1 13.47,21.24 R16.2
Q4C
  Top 0.203: Q4.3 DISP4.COM1 DISP4.COM2
Q5B
  Top 0.203: Q5.1 13.47,12.35 R17.2
Q5C
  Top 0.203: Q5.3 DISP5.COM1 DISP5.COM2
Q6B
  Top 0.203: R18.2 11.97,3.26 Q6.1
Q6C  (1 unrouted)
  Top 0.203: DISP6.COM1 Q6.3
  Bottom 0.203: DISP6.COM2 1.68,4.82 3.25,3.25 7.11,3.25 9.3,5.44 9.3,5.69
RSET  (via drill 0.3)
  Top 0.203: v49.38,17.88 49.99,17.48 U1.6 | v48.16,17.88 48.16,22.35 38.4,22.35 38,21.95 26.21,21.95 v26.01,21.74 | v18.69,28.65 24.99,28.65 v26.01,27.64
  Bottom 0.203: v26.01,27.64 v26.01,21.74 | v48.16,17.88 v49.38,17.88 | BU-RESET.1A 18.29,23.98 18.29,28.25 v18.69,28.65
SCL
  Top 0.203: U1.29 72.34,18.29 72.54,18.49 72.54,20.12 72.95,20.52 76.4,20.52 76.6,20.73 76.6,21.95 76.63,21.97 U4.6
SDA
  Top 0.203: U1.28 66.85,17.48 67.26,17.88 72.54,17.88 72.95,18.29 72.95,19.91 73.15,20.12 76.6,20.12 77.01,20.52 77.01,21.13 77.82,21.95 77.82,22.64 U4.5
SST  (via drill 0.3)
  Top 0.203: U1.7 49.58,16.68 v49.38,16.66 | v27.63,12.19 27.63,11.79 48.16,11.79 48.36,11.99 48.36,16.46 v48.16,16.66
  Bottom 0.203: v48.16,16.66 v49.38,16.66 | v27.63,12.19 27.63,5 U$2.NC
STEP  (via drill 0.3)  (1 unrouted)
  Top 0.203: U1.5 54.05,18.29 50.19,18.29 50.19,22.76 38.2,22.76 37.79,22.35 26.41,22.35 26.01,22.76 19.91,22.76 v19.71,22.55
  Bottom 0.203: v19.71,22.55 19.91,22.76 19.91,26.21 19.71,26.42 19.71,35.76 18.29,36.98 18.29,37.39 BU-STEP.1A
USBD+
  Top 0.203: J1.D+ 60.15,48.1 60.15,49.38 60.35,49.58 62.38,49.58 62.58,49.38 62.58,41.66 62.79,41.45 82.29,41.45 82.5,41.25 82.5,15.44 82.09,15.04 65.98,15.04 U1.25
USBD-
  Top 0.203: J1.D- 60.85,49.06 60.96,49.17 61.97,49.17 62.18,48.97 62.18,41.25 62.38,41.05 81.89,41.05 82.09,40.84 82.09,15.85 81.68,15.44 67.26,15.44 66.83,15.88 U1.26
USBPOW
  Top 0.406: U3.1 57.64,44.29 C1.1 57.87,45.92 60.96,45.92 61.5,46.46 J1.VBUS
VCC  (via drill 0.3)
  Top 0.203: Q5.2 13.47,14.94 | 13.47,32.72 Q3.2 | 13.47,40.89 Q2.2 13.47,40.95 | 70.74,48.56 72.54,48.56 72.54,47.94 J2.2 | v65.02,39.42 69.71,39.42 R12.2 | C7.2 52.05,14.99 R10.2 | U4.8 74.17,22.79 | C2.2 67.98,19.19 68.48,18.69 71.93,18.69 72.13,18.9 72.13,20.32 72.74,20.93 73.96,20.93 74.17,21.13 74.17,22.64 U4.8 | C4.2 71.92,22.72 U4.8 | Q4.2 13.47,24.18 13.51,24.18 13.51,24.45 Q4.2
  Top 0.356: C6.2 arc-90 61.75,9.41 U1.19 v61.77,12.6 | v61.77,14.22 63.4,14.22 v63.4,20.3 63.4,20.73 v60.15,20.73 56.89,20.73 56.89,15.04 U1.9 51.95,15.07 C7.2 | v65.02,19.91 U1.31 arc-90 65.98,19.91 C2.2 | v60.15,22.35 U1.39 60.15,24.18 59.54,24.79 59.54,25.31 C5.2 | v65.02,39.42 64.89,39.28 U2.5 64.49,37.88 C11.2 63.31,37.8 v61.36,37.8 | 70.74,48.56 70.74,42.67 v65.23,42.67 65.23,48.36 66.24,49.58 66.24,53.03 65.84,53.44 16.05,53.44 v15.44,52.93 | 12.39,40.95 10.46,40.95 10.46,47.14 12.39,47.14 12.39,49.21 Q1.2 11.78,49.21 v11.78,49.99 | 12.39,40.95 13.47,40.95 | 12.39,32.72 10.46,32.72 10.46,39.01 12.39,39.01 12.39,40.95 | 12.39,32.72 13.47,32.72 | 12.39,24.45 10.46,24.45 10.46,30.79 12.39,30.79 12.39,32.72 | 12.39,24.45 Q4.2 | 12.39,14.92 10.46,14.92 10.46,22.55 12.39,22.55 12.39,24.45 | 12.39,14.92 Q5.2 | Q6.2 10.46,6.67 10.46,13.01 12.39,13.01 12.39,14.92
  Top 0.406: U2.5 64.8,38.2 | U1.19 61.77,11.7
  Bottom 0.356: v61.77,14.22 v61.77,12.6 | v63.4,20.3 v65.02,19.91 | v60.15,22.35 v60.15,20.73 60.15,25.81 59.54,26.42 59.54,33.53 60.15,34.14 60.15,36.98 60.96,37.8 v61.36,37.8 v62.18,37.8 | v65.02,39.42 65.23,39.62 v65.23,42.67 | v15.44,52.93 13.71,52.93 11.78,51 v11.78,49.99
XTAL1  (via drill 0.3)
  Top 0.203: 61.75,23.95 U1.37 61.75,22.38 v61.77,22.35 | X1.XTAL2 60.27,28.12 v60.35,28.04 | v67.87,29.87 67.87,31 C9.2
  Bottom 0.203: 61.77,26.62 v60.35,28.04 | v61.77,22.35 61.77,26.62 | 61.77,26.62 65.23,26.62 67.87,29.26 v67.87,29.87

### Text on the board
tPlace: POS+ | NEG- | LIPO | ATXMEGA32U4 | SmallRoomLlabs.com/kimcard | creativecommons.org/licenses/by-sa/3.0
bPlace: PWR | CHG | CPU | POWER | SST
tStop: KimCard r2